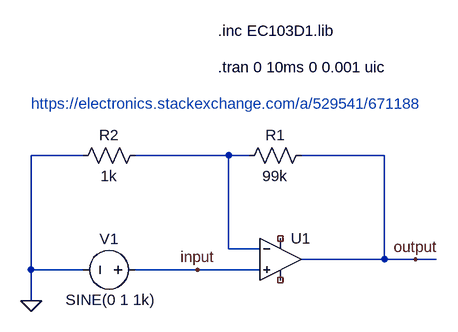
[diagram p0: schematic opamp.asc]
opamp.asc, the LTspice schematic file:
Version 4
SHEET 1 3836 760
WIRE 304 0 224 0
WIRE 528 0 384 0
WIRE 560 0 528 0
WIRE 768 0 640 0
WIRE 528 144 528 0
WIRE 576 144 528 144
WIRE 768 160 768 0
WIRE 768 160 640 160
WIRE 816 160 768 160
WIRE 848 160 816 160
WIRE 224 176 224 0
WIRE 304 176 224 176
WIRE 480 176 384 176
WIRE 576 176 480 176
WIRE 224 224 224 176
FLAG 224 224 0
FLAG 816 160 output
FLAG 480 176 input
SYMBOL voltage 400 176 M270
WINDOW 0 32 56 VTop 2
WINDOW 3 -46 -15 VRight 2
WINDOW 123 0 0 Left 0
WINDOW 39 0 0 Left 0
SYMATTR InstName V1
SYMATTR Value SINE(0 1 1k)
SYMBOL OpAmps\\UniversalOpAmp 608 160 R0
SYMATTR InstName U1
SYMBOL res 656 -16 R90
WINDOW 0 0 56 VBottom 2
WINDOW 3 32 56 VTop 2
SYMATTR InstName R1
SYMATTR Value 99k
SYMBOL res 400 -16 R90
WINDOW 0 0 56 VBottom 2
WINDOW 3 32 56 VTop 2
SYMATTR InstName R2
SYMATTR Value 1k
TEXT 512 -192 Left 2 !.inc EC103D1.lib
TEXT 512 -136 Left 2 !.tran 0 10ms 0 0.001 uic
TEXT 224 -80 Left 2 ;https://electronics.stackexchange.com/a/529541/671188

The netlist it stands for:
* opamp.asc
V1 input 0 SINE(0 1 1k)
XU1 input N001 NC_01 NC_02 output level1 Avol=1Meg GBW=10Meg Vos=0 En=0 Enk=0 In=0 Ink=0 Rin=500Meg  ; pins In+ In- V+ V- OUT
R1 output N001 99k
R2 N001 0 1k
.inc EC103D1.lib
.tran 0 10ms 0 0.001 uic
* https://electronics.stackexchange.com/a/529541/671188
.lib UniversalOpAmp1.lib
.backanno
.end